# Altium schematic sheet dc-dc_eth+pump.SchDoc
size 420 x 297 mm; Address1: Address1; Address2: Address2; Address3: Address3; Address4: Address4; DocumentNumber: 4; SheetNumber: 4; SheetTotal: 6; Перв_применение: Э3
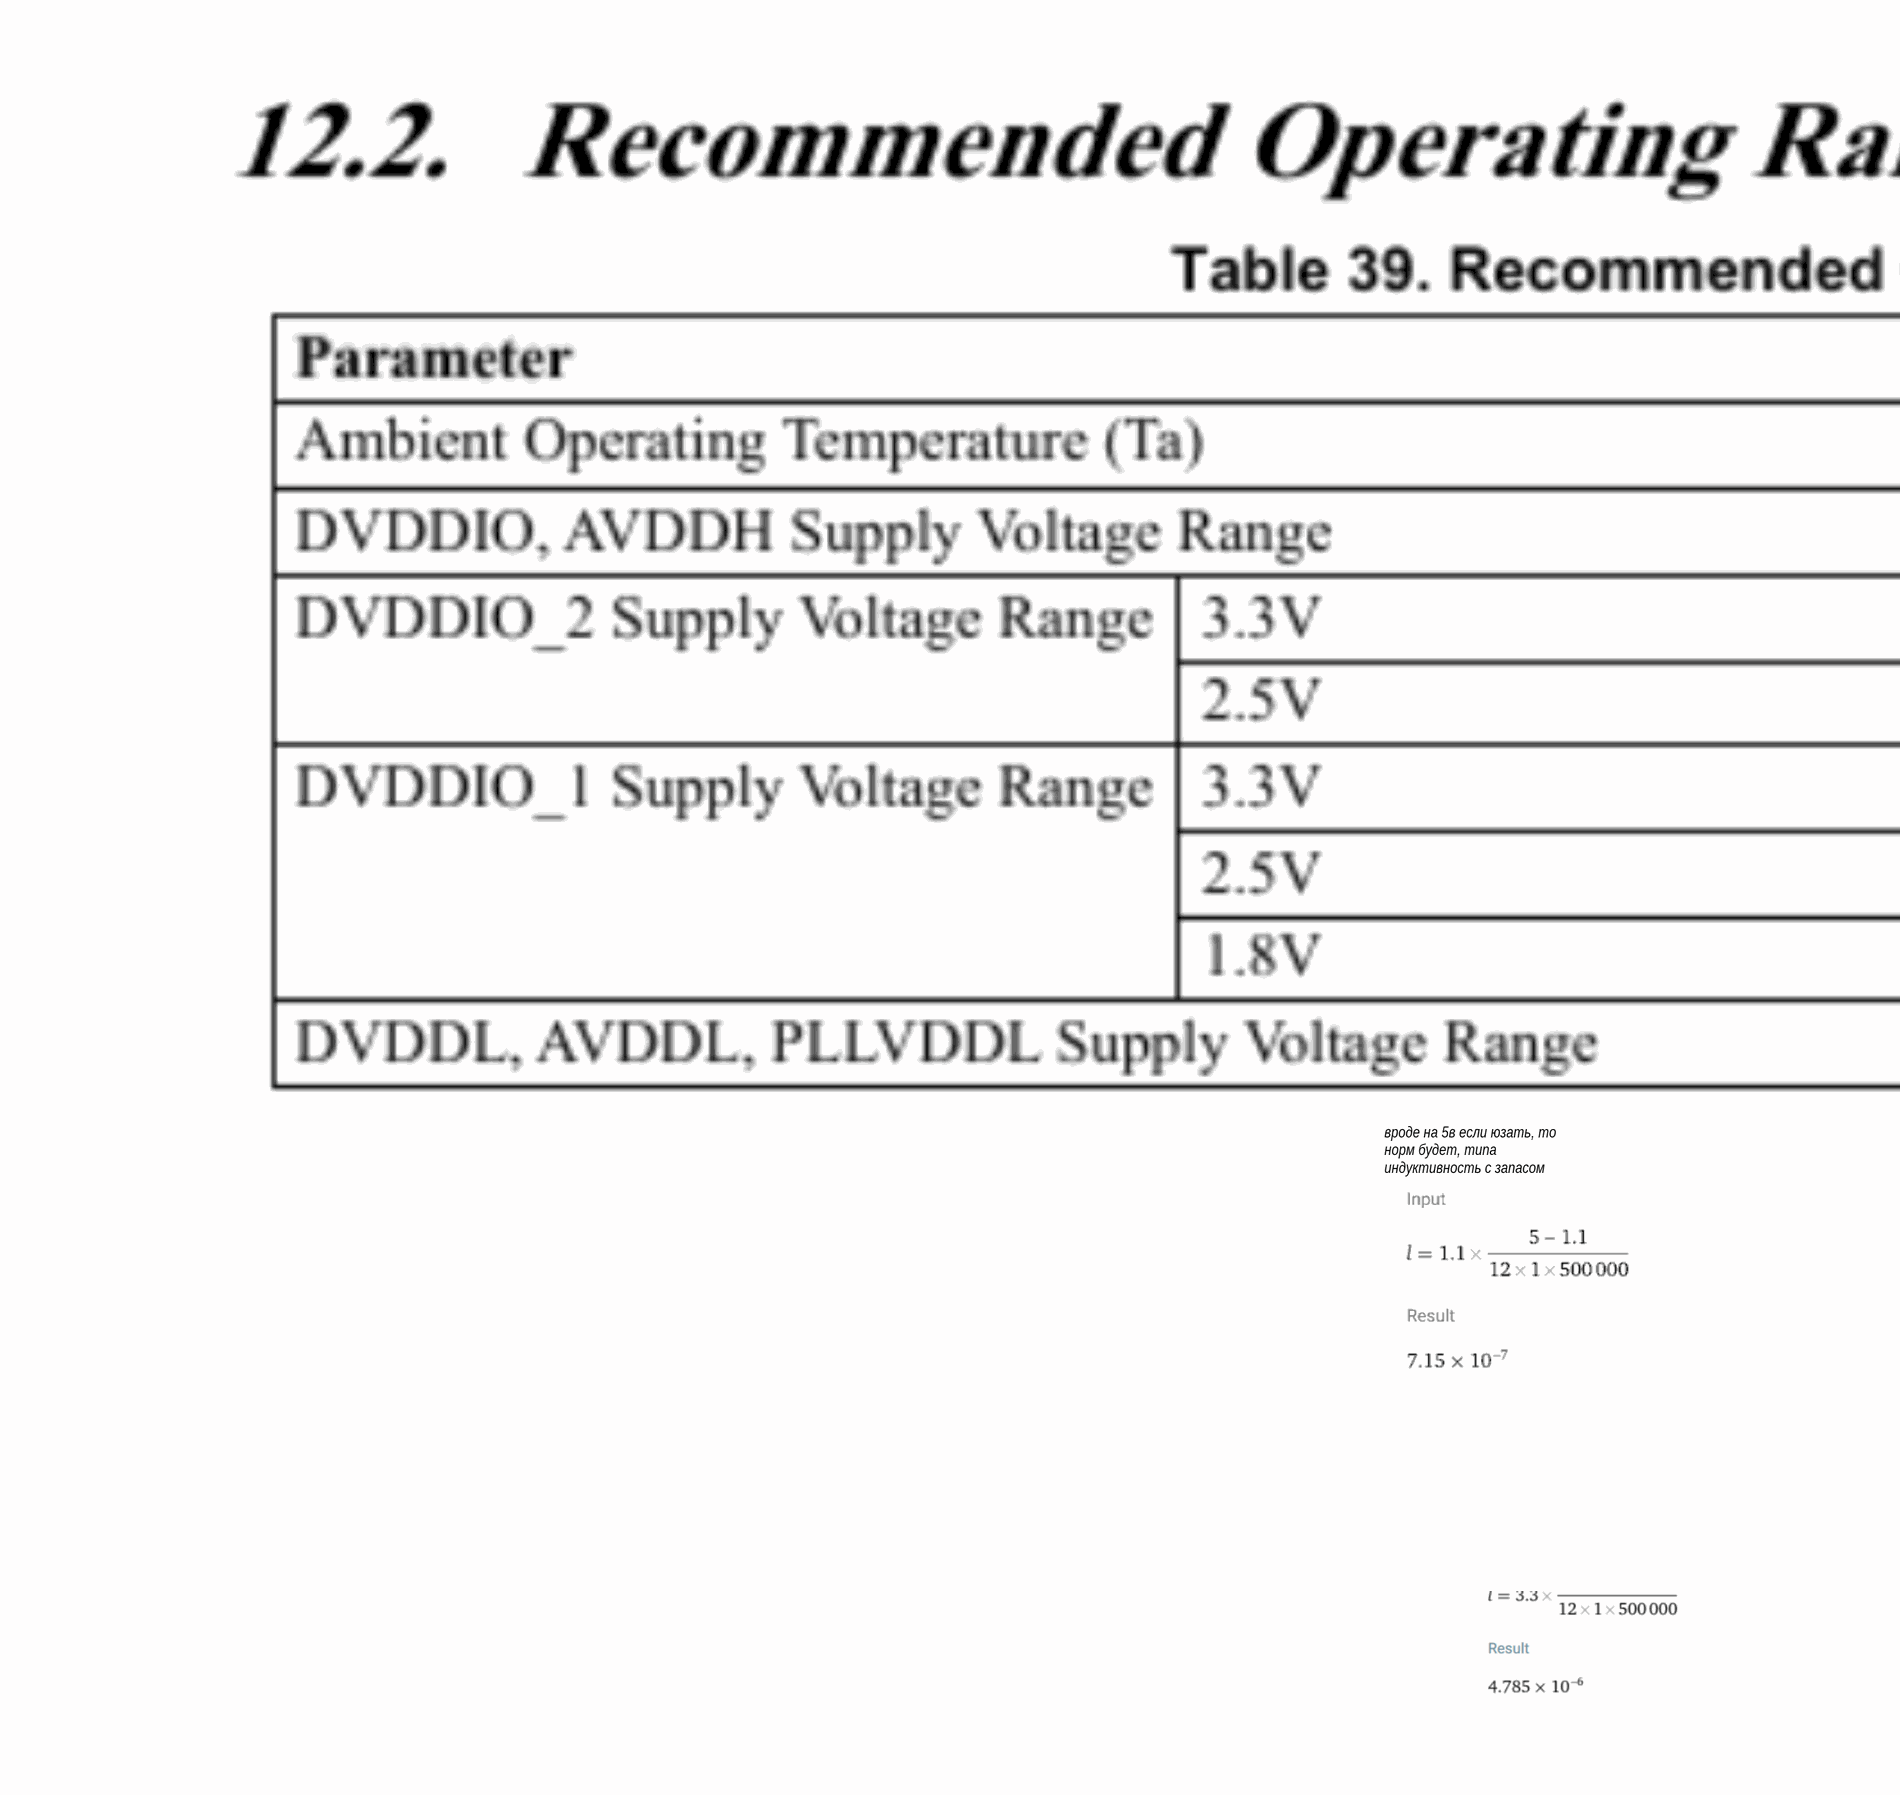
[diagram p0: dc-dc_eth+pump.SchDoc, top left]
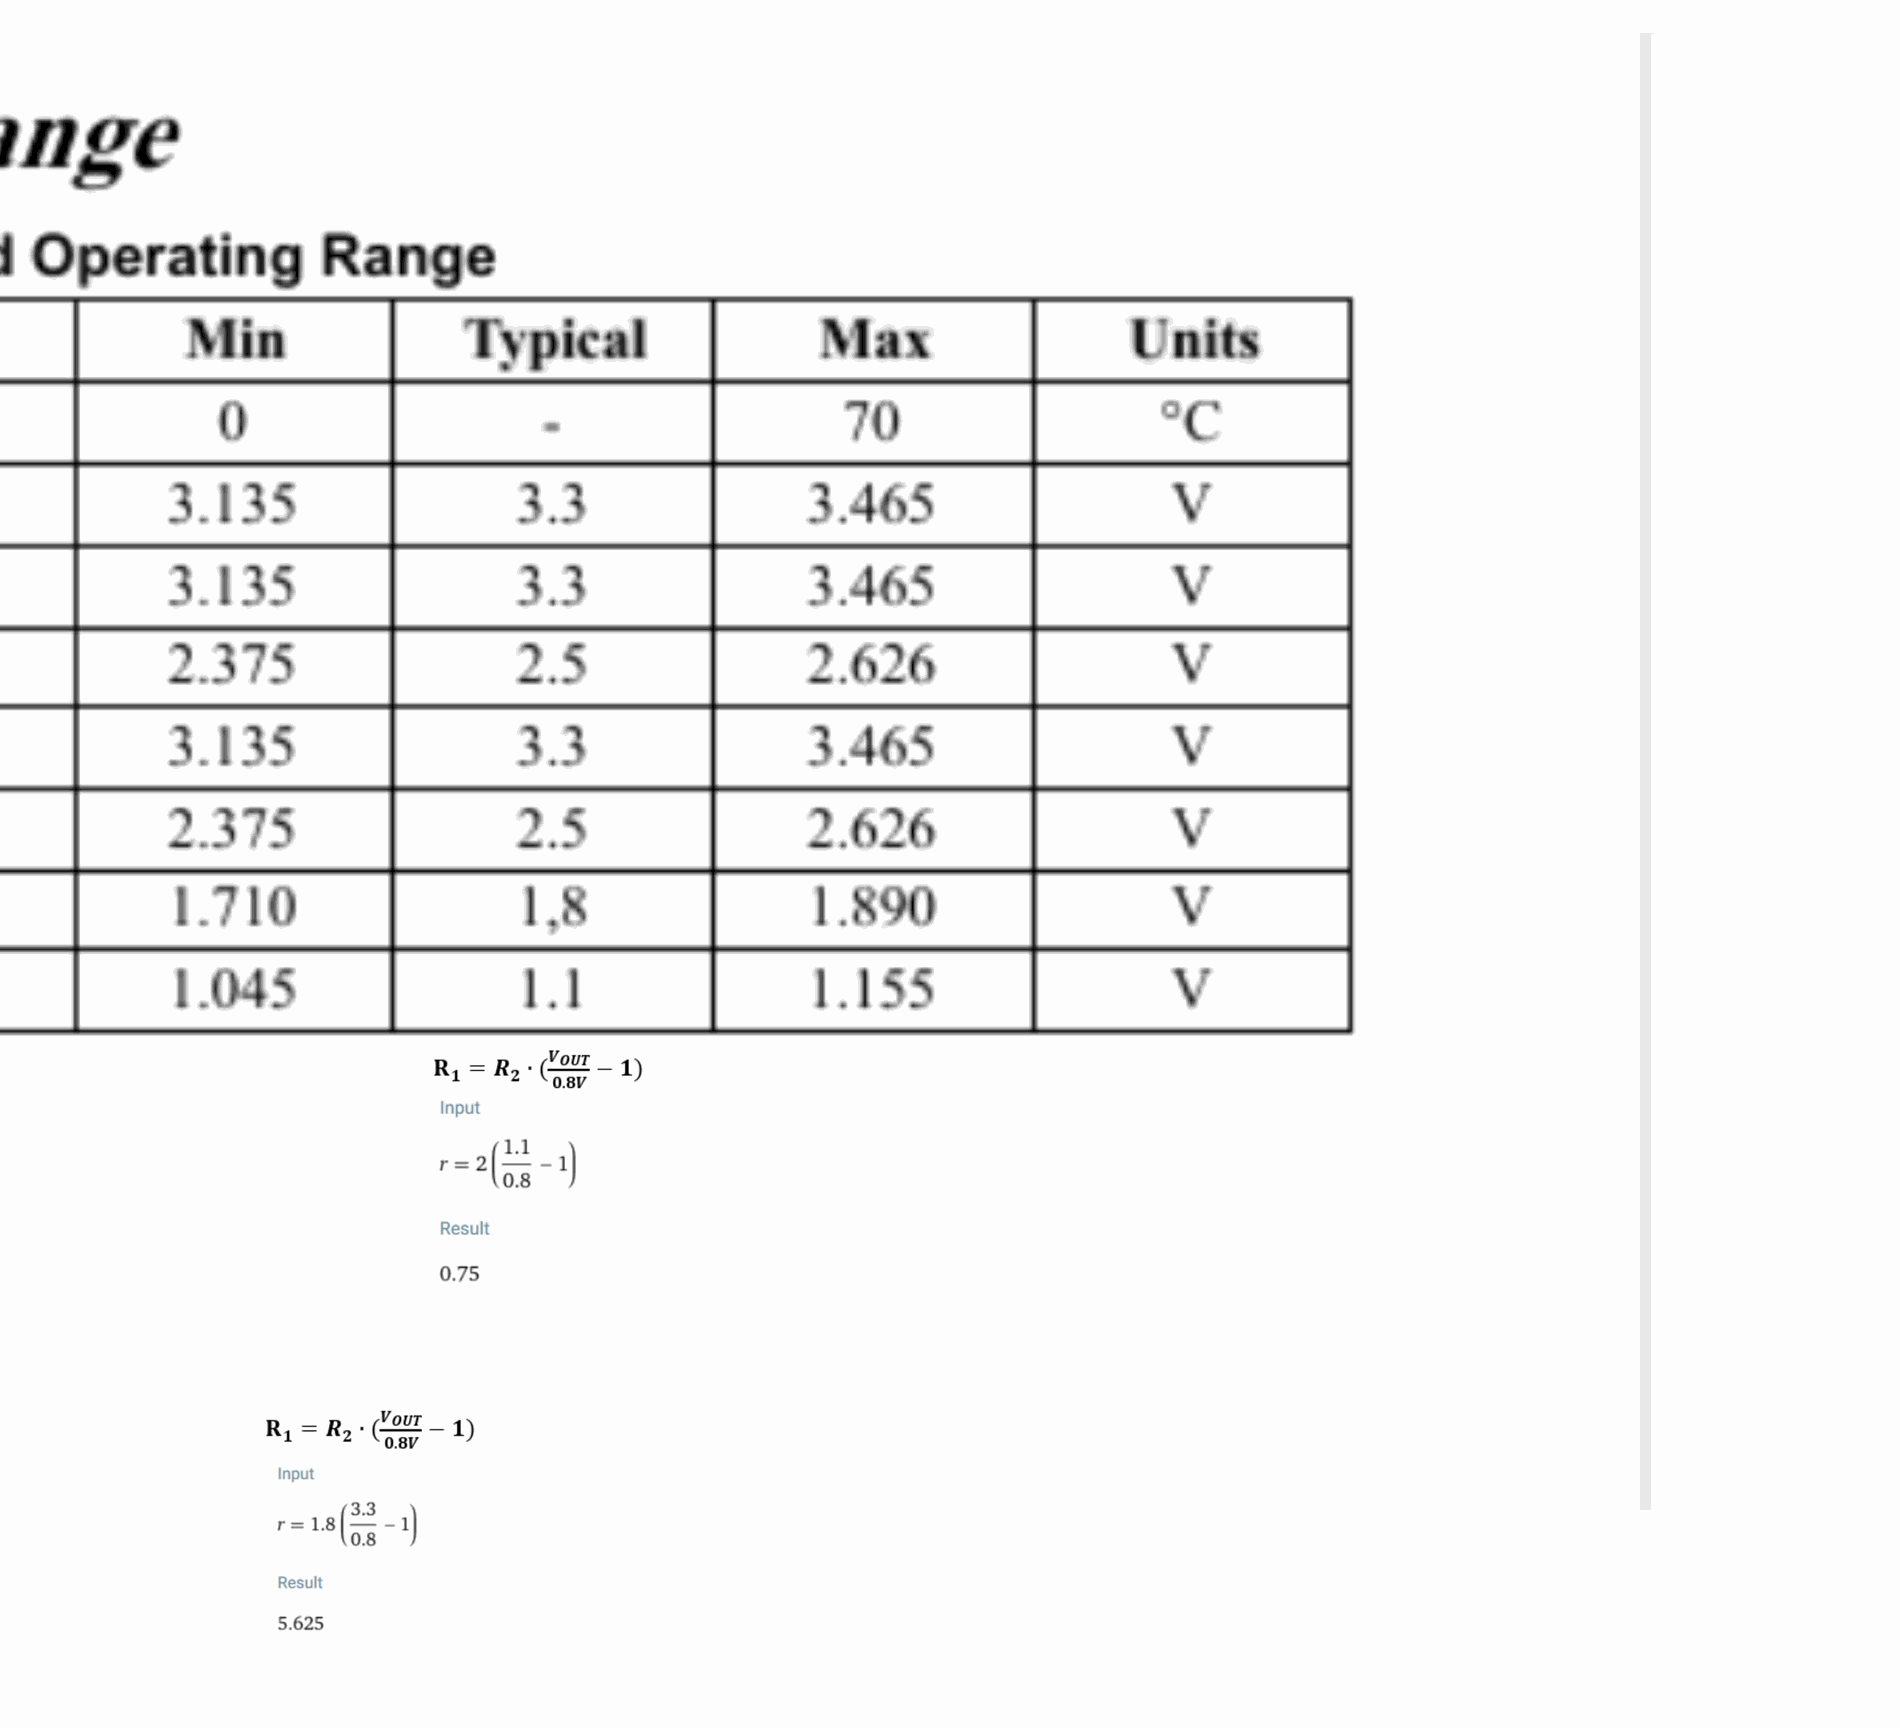
[diagram p1: dc-dc_eth+pump.SchDoc, top right]
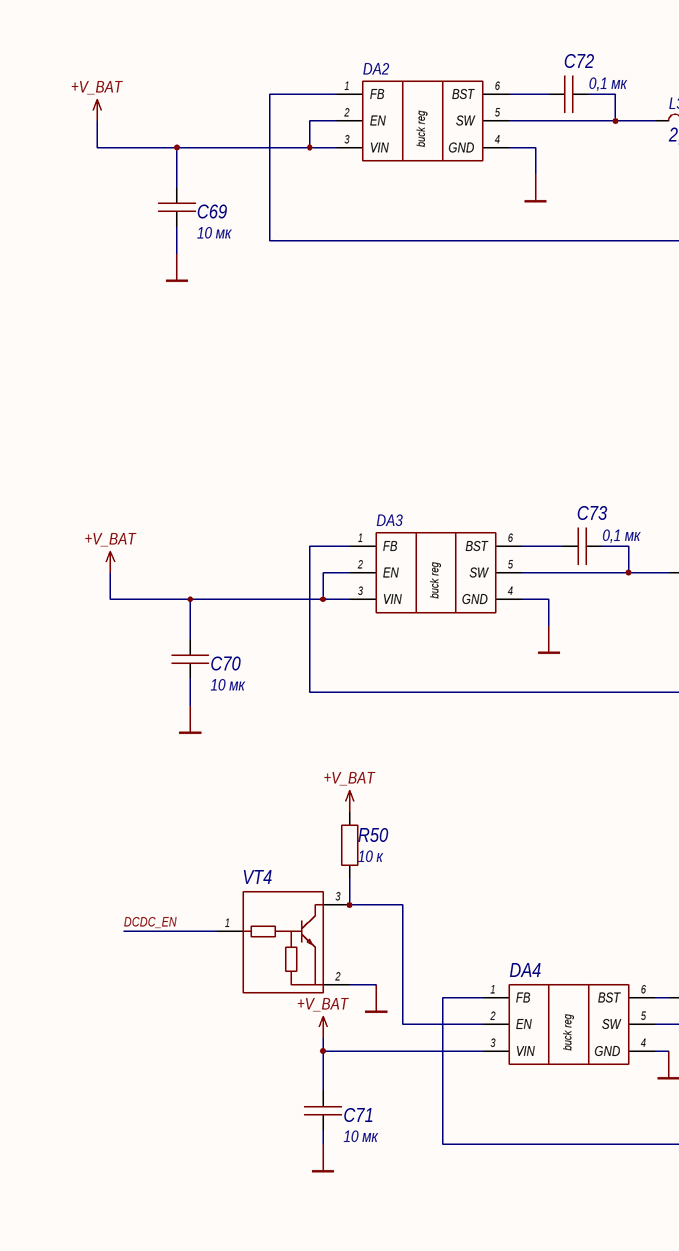
[diagram p2: dc-dc_eth+pump.SchDoc, bottom left]
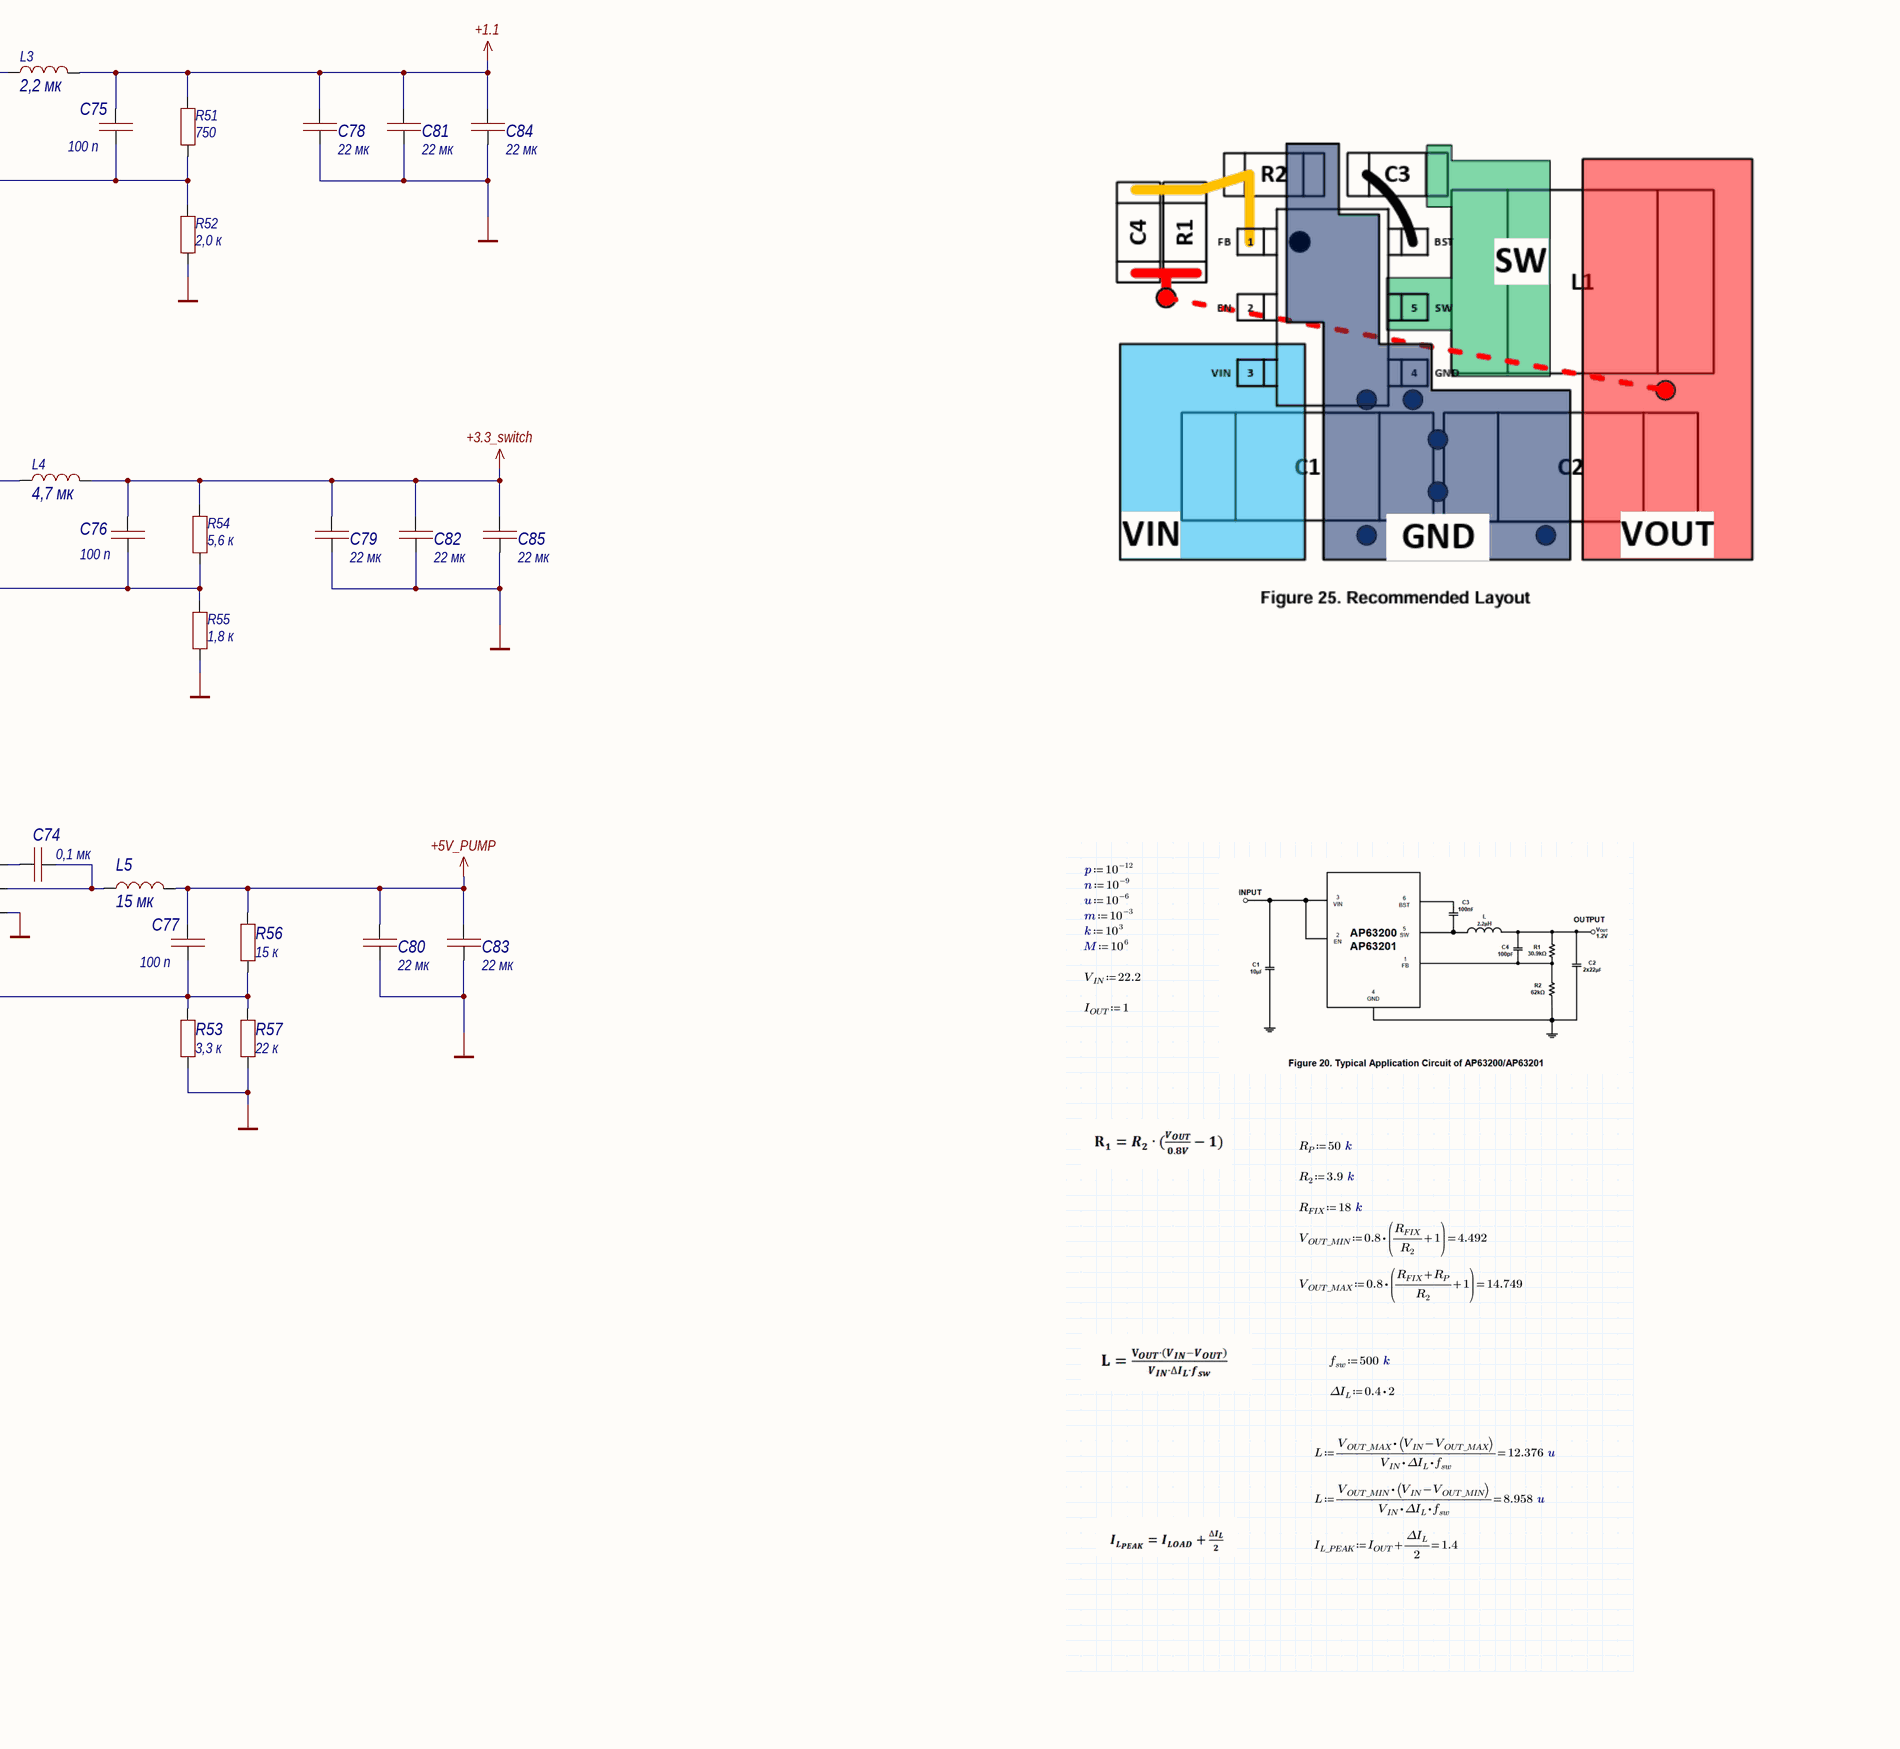
[diagram p3: dc-dc_eth+pump.SchDoc, bottom right]

## Parts
C69  value 10 мк  [1210C]  (hidden comment: Capacitor)
C70  value 10 мк  [1210C]  (hidden comment: Capacitor)
C71  value 10 мк  [1210C]  (hidden comment: Capacitor)
C72  value 0,1 мк  [0603C]  (hidden comment: Capacitor)
C73  value 0,1 мк  [0603C]  (hidden comment: Capacitor)
C74  value 0,1 мк  [0603C]  (hidden comment: Capacitor)
C75  value 100 п  [0603C]  (hidden comment: Capacitor)
C76  value 100 п  [0603C]  (hidden comment: Capacitor)
C77  value 100 п  [0603C]  (hidden comment: Capacitor)
C78  value 22 мк  [1210C]  (hidden comment: Capacitor)
C79  value 22 мк  [1210C]  (hidden comment: Capacitor)
C80  value 22 мк  [1210C]  (hidden comment: Capacitor)
C81  value 22 мк  [1210C]  (hidden comment: Capacitor)
C82  value 22 мк  [1210C]  (hidden comment: Capacitor)
C83  value 22 мк  [1210C]  (hidden comment: Capacitor)
C84  value 22 мк  [1210C]  (hidden comment: Capacitor)
C85  value 22 мк  [1210C]  (hidden comment: Capacitor)
DA2  AP63200  [TSOT26]  (value not drawn)
DA3  AP63200  [TSOT26]  (value not drawn)
DA4  AP63200  [TSOT26]  (value not drawn)
L3  value 2,2 мк  [CDRH6D12]  (hidden comment: CDRH6D12NP-2R2NC)
L4  value 4,7 мк  [B82462G4]  (hidden comment: B82472G6472M)
L5  value 15 мк  [SP43]  (hidden comment: SP43-150K)
R50  value 10 к  [0603R]  (hidden comment: Resistor)
R51  value 750  [0603R]  (hidden comment: Resistor)
R52  value 2,0 к  [0603R]  (hidden comment: Resistor)
R53  value 3,3 к  [0603R]  (hidden comment: Resistor)
R54  value 5,6 к  [0603R]  (hidden comment: Resistor)
R55  value 1,8 к  [0603R]  (hidden comment: Resistor)
R56  value 15 к  [0603R]  (hidden comment: Resistor)
R57  value 22 к  [0603R]  (hidden comment: Resistor)
VT4  PDTC114ET  [SOT23-3]  (value not drawn)

## Nets
+1.1: C75.2 C78.2 C81.2 C84.2 L3.3 R51.2
+3.3_switch: C76.2 C79.2 C82.2 C85.2 L4.2 R54.2
+5V_PUMP: C77.2 C80.2 C83.2 L5.2 R56.2
+V_BAT: C69.2 C70.2 C71.2 DA2.2(EN) DA2.3(VIN) DA3.2(EN) DA3.3(VIN) DA4.3(VIN) R50.2
GND: C69.1 C70.1 C71.1 C78.1 C79.1 C80.1 C81.1 C82.1 C83.1 C84.1 C85.1 DA2.4(GND) DA3.4(GND) DA4.4(GND) R52.1 R53.1 R55.1 R57.1 VT4.2(E)
DCDC_EN: VT4.1(B)
NetC72_1: C72.1 DA2.6(BST)
NetC72_2: C72.2 DA2.5(SW) L3.1
NetC73_1: C73.1 DA3.6(BST)
NetC73_2: C73.2 DA3.5(SW) L4.1
NetC74_1: C74.1 DA4.6(BST)
NetC74_2: C74.2 DA4.5(SW) L5.1
NetC75_1: C75.1 DA2.1(FB) R51.1 R52.2
NetC76_1: C76.1 DA3.1(FB) R54.1 R55.2
NetC77_1: C77.1 DA4.1(FB) R53.2 R56.1 R57.2
NetDA4_2: DA4.2(EN) R50.1 VT4.3(C)

## Notes on the sheet
- вроде на 5в если юзать, то норм будет, типа индуктивность с запасом
- Перв. примен.
- Справ. №
- Подп. и дата
- Инв. № дубл.
- Взам. инв. №
- Инв. № подл.
- Изм.
- Лист
- № докум.
- Подп.
- Дата
- Копировал
- Формат А3
- (in symbol AP63200) buck reg

## Library data of the parts
C69-C71 = Capacitor_10u_10_35V_X7R_1210C: Конденсатор 1210C ёмкостью 10 мк 10%, 35 В, X7R; Voltage (V): 35; Capacity (nF): 10000; Part Number: Capacitor_10u_10_35V_X7R_1210C; Tolerance: 10%; Dielectric: X7R
C72-C74 = Capacitor_0,1u_10_50V_X7R_0603C: Конденсатор 0603C ёмкостью 0,1 мк 10%, 50 В, X7R; Voltage (V): 50; Capacity (nF): 100; Part Number: Capacitor_0,1u_10_50V_X7R_0603C; Tolerance: 10%; Dielectric: X7R
C75-C77 = Capacitor_100p_10_50V_X7R_0603C: Конденсатор 0603C ёмкостью 100 п 10%, 50 В, X7R; Voltage (V): 50; Capacity (nF): 0,1; Part Number: Capacitor_100p_10_50V_X7R_0603C; Tolerance: 10%; Dielectric: X7R
C78-C85 = Capacitor_22u_10_25V_X7R_1210C: Конденсатор 1210C ёмкостью 22 мк 10%, 25 В, X7R; Voltage (V): 25; Capacity (nF): 22000; Part Number: Capacitor_22u_10_25V_X7R_1210C; Tolerance: 10%; Dielectric: X7R
DA2-DA4 = AP63200: DC-DC понижающий преобразователь, Vin: 3.8 - 40 В, adj, 2 А; Part Number: AP63200
L3 = CDRH6D12NP-2R2NC: Индуктивность на 2,2 мкГн, номинальный ток 2,5 А; Inductance (μH): 2,2; Current: 2,5 А; Автор: rreali; Part Number: CDRH6D12NP-2R2NC
L4 = B82472G6472M: Индуктивность на 4,7 мкГн, номинальный ток 2,5 А; Inductance (μH): 4,7; Current: 2,5 А; Автор: rreali; Part Number: B82472G6472M
L5 = SP43-150K: Индуктивность на 15 мкГн, номинальный ток 1,3 А; Inductance (μH): 15; Current: 1,3 А; Part Number: SP43-150K
R50 = Resistor_10k_1_0603: Резистор номиналом 10 кОм 1%; Power: *; Part Number: Resistor_10k_1_0603; Tolerance: 1%
R51 = Resistor_750_1_0603: Резистор номиналом 750 Ом 1%; Power: *; Part Number: Resistor_750_1_0603; Tolerance: 1%
R52 = Resistor_2.0k_1_0603: Резистор номиналом 2,0 кОм 1%; Power: *; Part Number: Resistor_2.0k_1_0603; Tolerance: 1%
R53 = Resistor_3.3k_1_0603: Резистор номиналом 3,3 кОм 1%; Power: *; Part Number: Resistor_3.3k_1_0603; Tolerance: 1%
R54 = Resistor_5.6k_1_0603: Резистор номиналом 5,6 кОм 1%; Power: *; Part Number: Resistor_5.6k_1_0603; Tolerance: 1%
R55 = Resistor_1.8k_1_0603: Резистор номиналом 1,8 кОм 1%; Power: *; Part Number: Resistor_1.8k_1_0603; Tolerance: 1%
R56 = Resistor_15k_1_0603: Резистор номиналом 15 кОм 1%; Power: *; Part Number: Resistor_15k_1_0603; Tolerance: 1%
R57 = Resistor_22k_1_0603: Резистор номиналом 22 кОм 1%; Power: *; Part Number: Resistor_22k_1_0603; Tolerance: 1%
VT4 = PDTC114ET: цифровой npn 50в 100мА; Current (A): 0, 1 А; Part Number: PDTC114ET; Voltage (V): 50 В